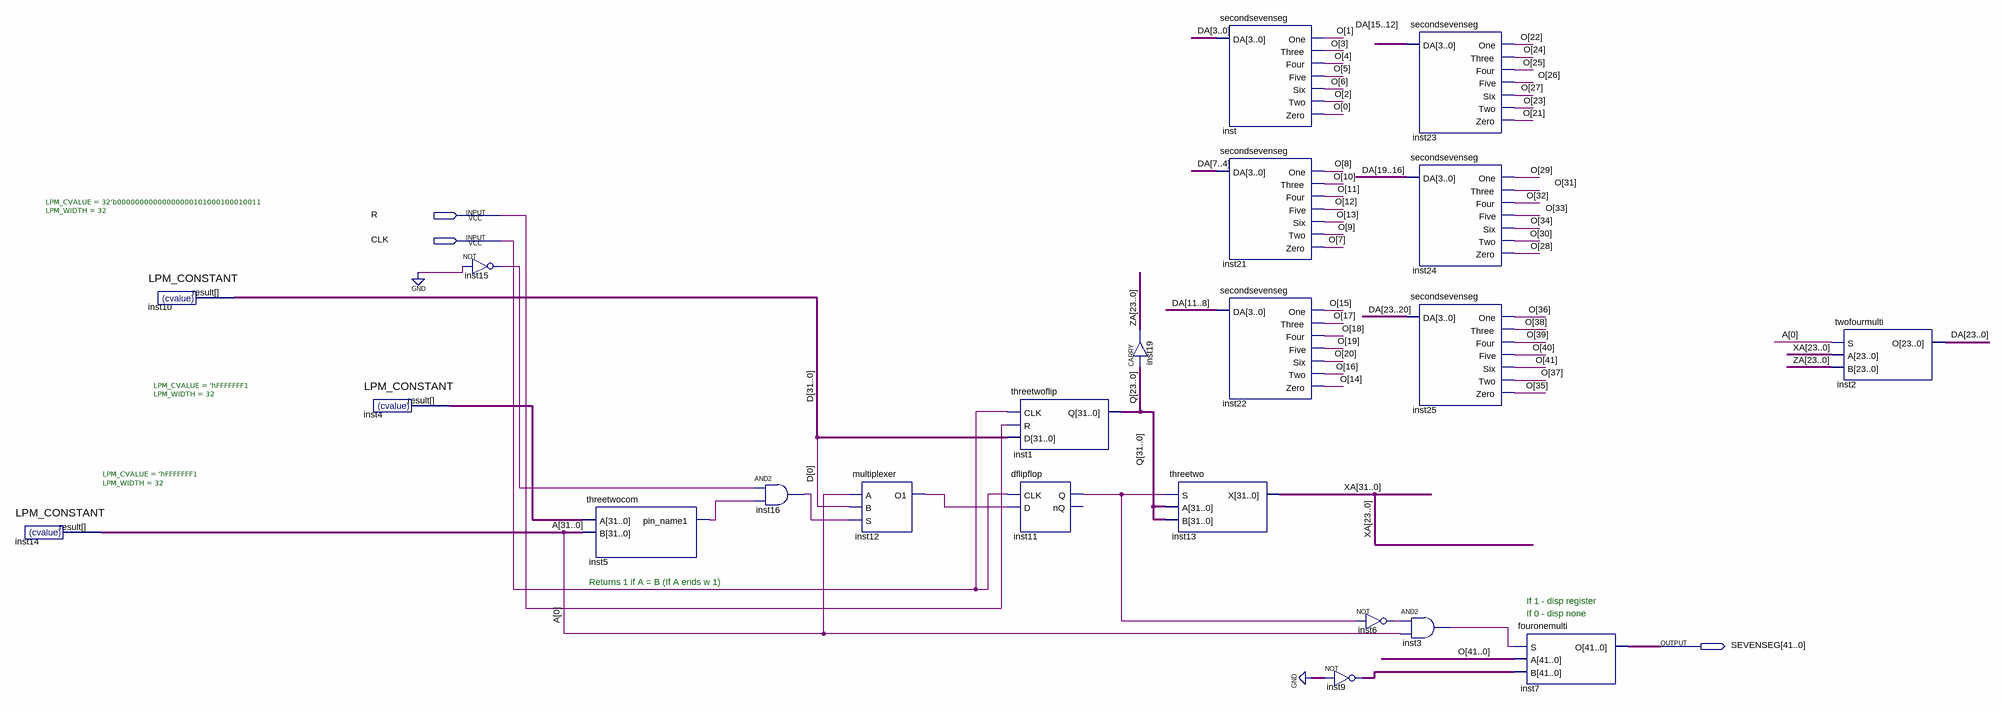
[diagram p0: schematic sheet]
// Quartus schematic sourcetwo.bdf as structural Verilog: 22 symbols, 3 pins
module sourcetwo (
  input  R,
  input  CLK,
  output [41:0] SEVENSEG
);

  wire inst3_out, inst5_pin_name1, inst6_out, inst11_q, inst12_o1, inst15_out, inst16_out;
  wire [23:0] DA, ZA;
  wire [31:0] A, D, inst4_result, Q, XA;
  wire [41:0] inst9_out, O;

  LPM_CONSTANT #(.LPM_CVALUE('hFFFFFFF1), .LPM_WIDTH(32)) inst14 (.result(A));
  LPM_CONSTANT #(.LPM_CVALUE(32'b00000000000000000101000100010011), .LPM_WIDTH(32)) inst10 (.result(D));
  LPM_CONSTANT #(.LPM_CVALUE('hFFFFFFF1), .LPM_WIDTH(32)) inst4 (.result(inst4_result));
  not inst15 (inst15_out, 1'b0);
  threetwocom inst5 (.A(inst4_result), .B(A), .pin_name1(inst5_pin_name1));
  and inst16 (inst16_out, inst15_out, inst5_pin_name1);
  multiplexer inst12 (.A(A[0]), .B(D[0]), .S(inst16_out), .O1(inst12_o1));
  threetwoflip inst1 (.CLK(CLK), .R(R), .D(D), .Q(Q));
  dflipflop inst11 (.CLK(CLK), .D(inst12_o1), .Q(inst11_q));  // open: nQ
  CARRY inst19[23:0] (.IN(Q[23:0]), .OUT(ZA));
  threetwo inst13 (.S(inst11_q), .A(Q), .B(Q), .X(XA));
  secondsevenseg inst (
    .DA(DA[3:0]), .One(O[1]), .Three(O[3]), .Four(O[4]), .Five(O[5]), .Six(O[6]), .Two(O[2]), .Zero(O[0]));
  secondsevenseg inst21 (
    .DA(DA[7:4]), .One(O[8]), .Three(O[10]), .Four(O[11]), .Five(O[12]), .Six(O[13]), .Two(O[9]), .Zero(O[7]));
  secondsevenseg inst22 (
    .DA(DA[11:8]), .One(O[15]), .Three(O[17]), .Four(O[18]), .Five(O[19]), .Six(O[20]), .Two(O[16]),
    .Zero(O[14]));
  assign inst9_out = ~{42{1'b0}};  // NOT inst9, 42 bits wide
  and inst3 (inst3_out, inst6_out, A[0]);
  not inst6 (inst6_out, inst11_q);
  secondsevenseg inst23 (
    .DA(DA[15:12]), .One(O[22]), .Three(O[24]), .Four(O[25]), .Five(O[26]), .Six(O[27]), .Two(O[23]),
    .Zero(O[21]));
  secondsevenseg inst24 (
    .DA(DA[19:16]), .One(O[29]), .Three(O[31]), .Four(O[32]), .Five(O[33]), .Six(O[34]), .Two(O[30]),
    .Zero(O[28]));
  secondsevenseg inst25 (
    .DA(DA[23:20]), .One(O[36]), .Three(O[38]), .Four(O[39]), .Five(O[40]), .Six(O[41]), .Two(O[37]),
    .Zero(O[35]));
  fouronemulti inst7 (.S(inst3_out), .A(O), .B(inst9_out), .O(SEVENSEG));
  twofourmulti inst2 (.S(A[0]), .A(XA[23:0]), .B(ZA), .O(DA));

  // Notes on the sheet:
  //   Returns 1 if A = B (If A ends w 1)
  //   If 1 - disp register
  //   If 0 - disp none
endmodule
